# EAGLE design LCD_board_opensource (EAGLE 5.10)
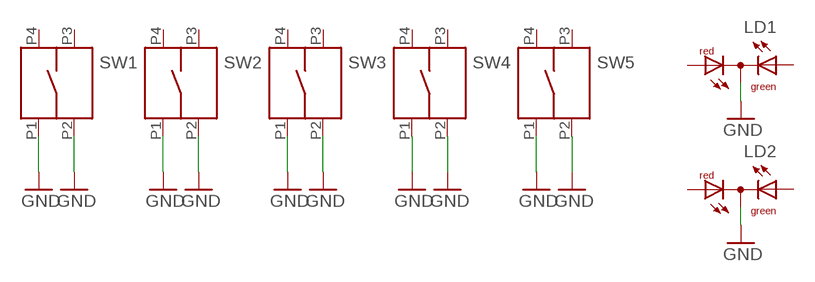
[diagram p0: schematic, sheet 1]

## Parts
LD1  DUOLED-RG-CSIDEWAYS  [DUOLED-A-3MM-SIDEWAYS]
LD2  DUOLED-RG-CSIDEWAYS  [DUOLED-A-3MM-SIDEWAYS]
SW1  KSC243JLFG  [KSC243JLFG]
SW2  KSC243JLFG  [KSC243JLFG]
SW3  KSC243JLFG  [KSC243JLFG]
SW4  KSC243JLFG  [KSC243JLFG]
SW5  KSC243JLFG  [KSC243JLFG]

## Nets
GND: LD1.2(C) LD2.2(C) SW1.P1 SW1.P2 SW2.P1 SW2.P2 SW3.P1 SW3.P2 SW4.P1 SW4.P2 SW5.P1 SW5.P2
Unconnected: LD1.1(AR) LD1.3(AG) LD2.1(AR) LD2.3(AG) SW1.P3 SW1.P4 SW2.P3 SW2.P4 SW3.P3 SW3.P4 SW4.P3 SW4.P4 SW5.P3 SW5.P4

## Library data of the parts
LD1 LD2 = led:DUOLED-RG-C: DUO LED 2 colors (red/green), 5 mm, round, common Cathode www.ligitek.com or other producers.
SW1-SW5 = SparkFun:KSC243JLFG

## Board
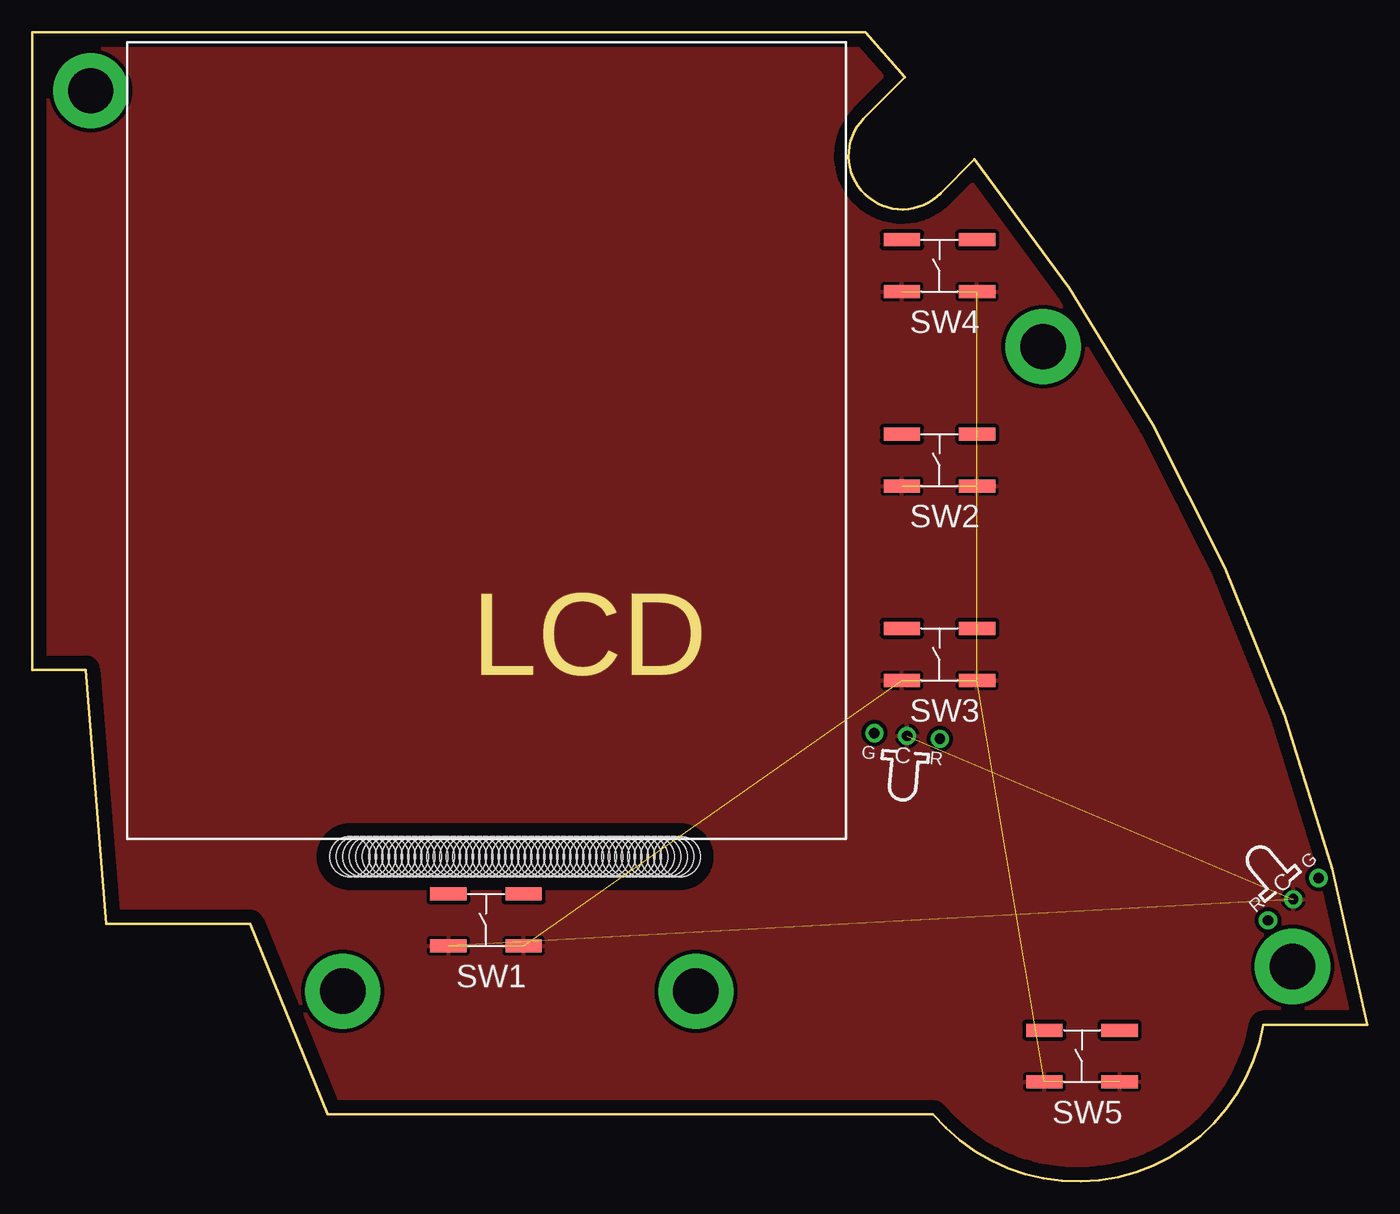
[diagram p1: board, top side]
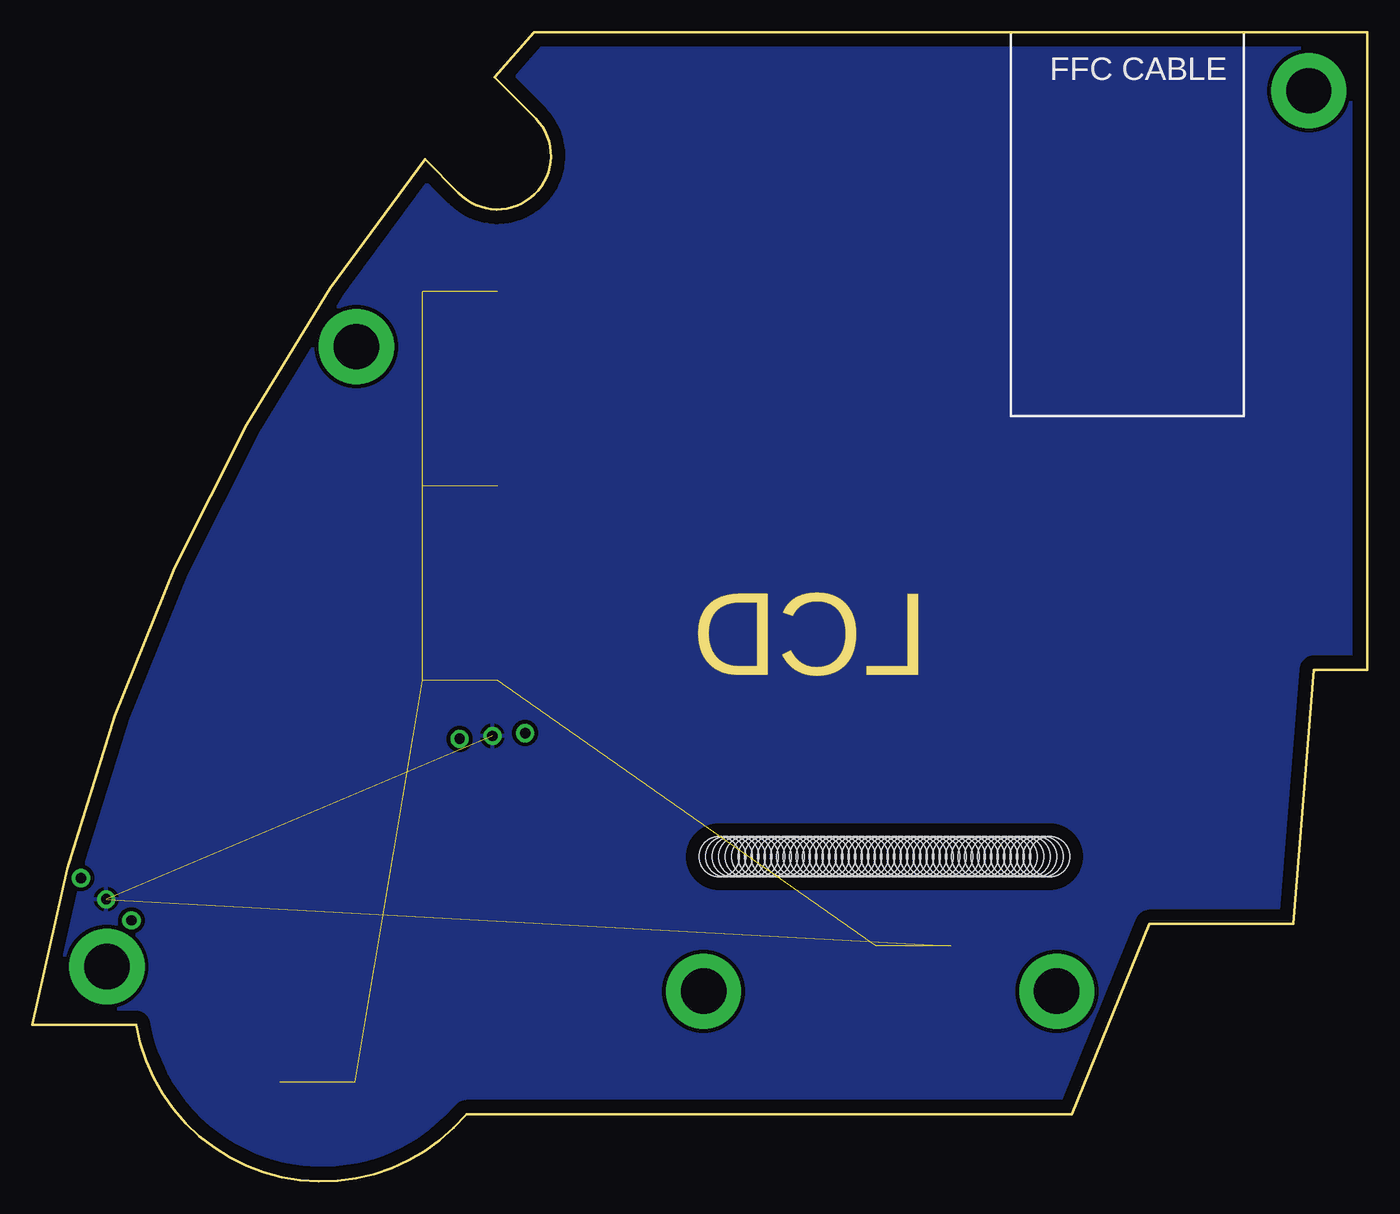
[diagram p2: board, bottom side, seen from below]

Size 103 x 88.68 mm. Coordinates in mm from the lower left corner, seen from the top.
Outline: 0,39.48 0,88.68 64.3,88.68 67.35,85.23 64.15,82.03 arc180 70.1,76.28 72.7,78.88 arc-28 103,12.08 95,12.08 arc-130 69.5,5.18 22.8,5.18 16.8,19.88 5.7,19.88 4.1,39.48 0,39.48
Copper layers (1*16): Top 0.035mm / dielectric 1.5mm / Bottom 0.035mm
Design rules "default *": minimum track width 10mil, minimum drill 24mil, track to track 8mil, track to pad 8mil, pad to pad 8mil, via to via 8mil, smd to smd 8mil, copper to edge 40mil, drill to drill 8mil, minimum pad ring 10mil, minimum via ring 8mil, stop-mask expansion 4mil, vias tented up to drill 0mil, thermal gap 10mil
Holes 3.1 mm at 24.5,25.08 25,25.08 25.5,25.08 26,25.08 26.5,25.08 27,25.08 27.5,25.08 28,25.08 28.5,25.08 29,25.08 29.5,25.08 30,25.08 30.5,25.08 31,25.08 31.5,25.08 32,25.08 32.5,25.08 33,25.08 33.5,25.08 34,25.08 34.5,25.08 35,25.08 35.5,25.08 36,25.08 36.5,25.08 37,25.08 37.5,25.08 38,25.08 38.5,25.08 39,25.08 39.5,25.08 40,25.08 40.5,25.08 41,25.08 41.5,25.08 42,25.08 42.5,25.08 43,25.08 43.5,25.08 44,25.08 44.5,25.08 45,25.08 45.5,25.08 46,25.08 46.5,25.08 47,25.08 47.5,25.08 48,25.08 48.5,25.08 49,25.08 49.5,25.08 50,25.08

### Footprints (pad centres in the part's own frame; a part is rotated, then mirrored left to right if it is on the bottom)
DUOLED-A-3MM-SIDEWAYS = drill 0.8 pad 1.4 round: 1 -2.54,0; 2 0,0; 3 2.54,0
KSC243JLFG = smd 2.8 x 1: P1 -2.9,-2; P2 2.9,-2; P3 2.9,2; P4 -2.9,2

### Placement (x,y rotation side)
LD1  97.3,21.78 40 top
LD2  67.5,34.38 175 top
SW1  35,20.18 0 top
SW2  70,55.68 0 top
SW3  70,40.68 0 top
SW4  70,70.68 0 top
SW5  81,9.68 0 top

### Tracks (layer width: path | path; a pad name or v marks a point on that pad's centre or on a via)
GND  (11 unrouted)
  pour Bottom (isolate 0.305): -16.8,111.78 -16.8,-8.62 122.3,-8.62 122.3,111.78
  pour Top (isolate 0.305): -19,114.68 -19,-11.02 126.8,-11.02 126.8,114.68
N$1  (via drill 3.5 pad 5.8)
  other vias: 4.5,84.18 78,64.43 23.95,14.68 51.2,14.68 97.25,16.58

### Text on the board
Dimension: LCD
tPlace: SW4 | SW2 | SW3 | SW1 | SW5
bPlace: FFC CABLE